# EAGLE design mbedshield040 (EAGLE 6.4)
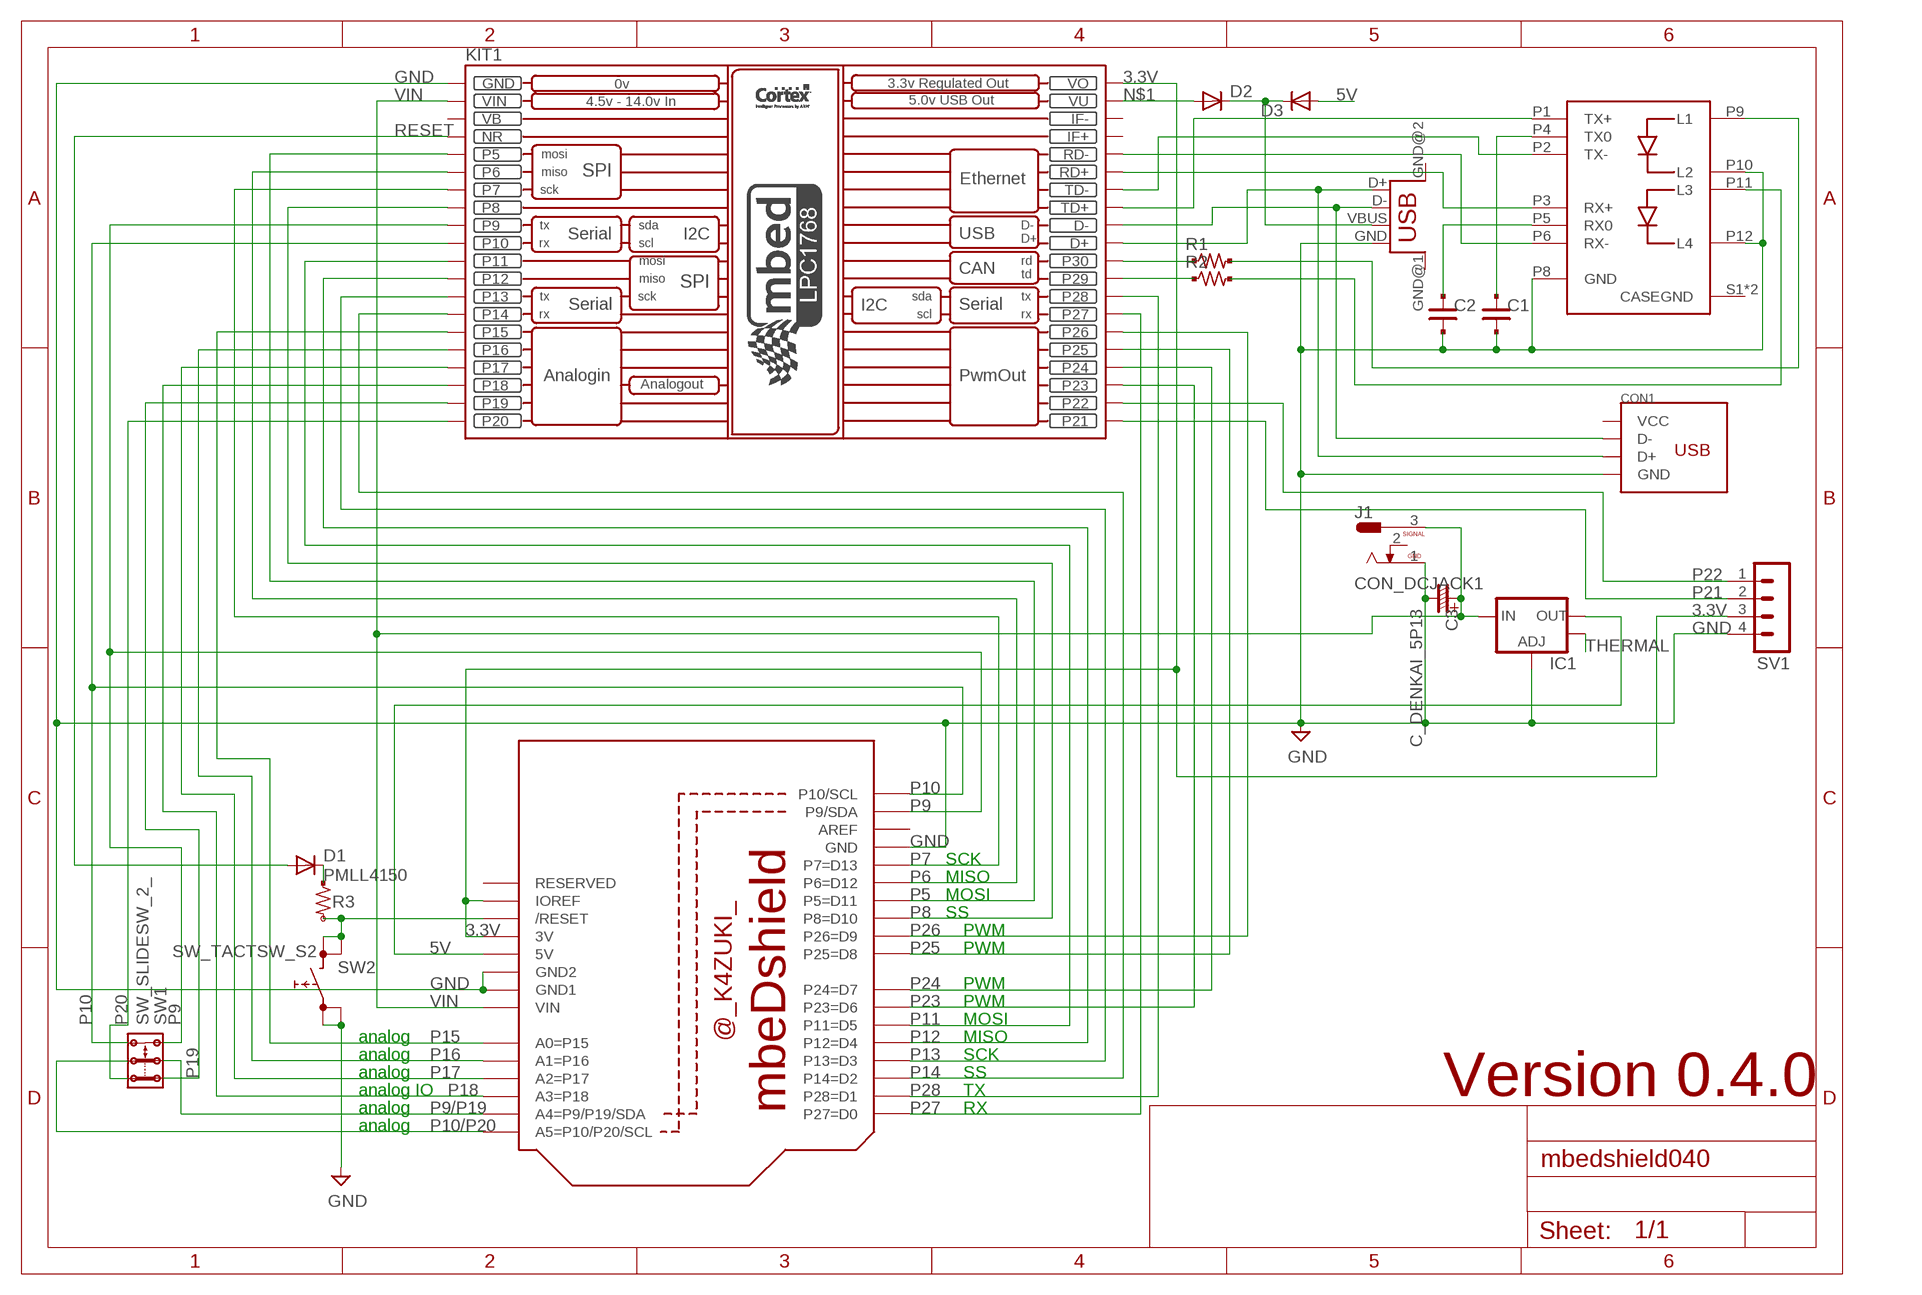
[diagram p0: schematic, sheet 1]

## Parts
C1  C_PAD_PAD_2125  [CR_2125]
C2  C_PAD_PAD_2125  [CR_2125]
C3  C_DENKAI_5P13  C_DENKAI_2.5P6  [C_2.5PHI6]
CON1  CON_USB  [CON_USB_MINIB_AKI]
D1  PMLL4150  [SOD80C]
D2  PMLL4150  [SOD80C]
D3  PMLL4150  [SOD80C]
IC1  V_REG_LM1117SOT223  [SOT223]
J1  CON_DCJACK1  [CON_DCJACK]
J2  CON_ETH_RJ45  [CON_LAN_RJ45_2LED_AKI]
KIT1  MBED_NXP_LPC1768  [MBED-KIT]
R1  R_US_PAD_PAD_1608  [R_1608_PADPAD]
R2  R_US_PAD_PAD_1608  [R_1608_PADPAD]
R3  R_US_PAD_VIA_2125  [R_2125_PADVIA]
SV1  MA04-1  [MA04-1]
SW1  SW_SLIDESW_2_  [SW_SLIDE_2X2_1]
SW2  SW_TACTSW_S2  [SW_TACTSW_B3F-10XX]
U$1  BOARD_MBEDSHIELD  [BOARD_MBEDSHIOELD]
USB  USB  [USB-FEMALE-A-PTH]

## Nets
3.3V: KIT1.VOUT(VO) SV1.3 U$1.3V U$1.IOREF
5V: D3.A IC1.2(OUT) U$1.5V
GND: C1.2 C2.2 C3.- CON1.GND IC1.1(ADJ) J1.1 J2.P8(GND) J2.P10(L2) J2.P12(L4) KIT1.GND SV1.4 SW2.1 SW2.2 U$1.GND U$1.GND1 U$1.GND2 USB.GND
N$1: D2.A KIT1.VU
N$27: D1.C R3.PAD
N$28: R3.VIA SW2.3 SW2.4 U$1.RESET(/RESET)
N$29: C1.1 J2.P4(TX0)
N$30: C2.1 J2.P5(RX0)
N$31: J2.P3(RX+) KIT1.RD+
N$32: J2.P6(RX-) KIT1.RD-
N$33: J2.P2(TX-) KIT1.TD-
N$34: J2.P1(TX+) KIT1.TD+
N$36: KIT1.P$30(P30) R1.1
N$37: KIT1.P$29(P29) R2.1
N$39: J2.P9(L1) R1.2
N$40: J2.P11(L3) R2.2
N$42: D2.C D3.C USB.VBUS
N$44: CON1.D- KIT1.D- USB.D-
N$45: CON1.D+ KIT1.D+ USB.D+
P5: KIT1.P$5(P5) U$1.D11(P5=D11)
P6: KIT1.P$6(P6) U$1.D12(P6=D12)
P7: KIT1.P$7(P7) U$1.D13(P7=D13)
P8: KIT1.P$8(P8) U$1.D10(P8=D10)
P9: KIT1.P$9(P9) SW1.2.1 U$1.SDA(P9/SDA)
P9/P19: SW1.COM.1 U$1.A4(A4=P9/P19/SDA)
P10: KIT1.P$10(P10) SW1.2.2 U$1.SCL(P10/SCL)
P10/P20: SW1.COM.2 U$1.A5(A5=P10/P20/SCL)
P11: KIT1.P$11(P11) U$1.D5(P11=D5)
P12: KIT1.P$12(P12) U$1.D4(P12=D4)
P13: KIT1.P$13(P13) U$1.D3(P13=D3)
P14: KIT1.P$14(P14) U$1.D2(P14=D2)
P15: KIT1.P$15(P15) U$1.A0(A0=P15)
P16: KIT1.P$16(P16) U$1.A1(A1=P16)
P17: KIT1.P$17(P17) U$1.A2(A2=P17)
P18: KIT1.P$18(P18) U$1.A3(A3=P18)
P19: KIT1.P$19(P19) SW1.1.1
P20: KIT1.P$20(P20) SW1.1.2
P21: KIT1.P$21(P21) SV1.2
P22: KIT1.P$22(P22) SV1.1
P23: KIT1.P$23(P23) U$1.D6(P23=D6)
P24: KIT1.P$24(P24) U$1.D7(P24=D7)
P25: KIT1.P$25(P25) U$1.D8(P25=D8)
P26: KIT1.P$26(P26) U$1.D9(P26=D9)
P27: KIT1.P$27(P27) U$1.D0(P27=D0)
P28: KIT1.P$28(P28) U$1.D1(P28=D1)
RESET: D1.A KIT1.NR
THERMAL: IC1.4(OUT)
VIN: C3.+ IC1.3(IN) J1.3 KIT1.VIN U$1.VIN
Unconnected: CON1.VBUS(VCC) J1.2 J2.S1(CASEGND) J2.S2(CASEGND) KIT1.IF+ KIT1.IF- U$1.AREF U$1.RESERVED USB.GND@1(GND) USB.GND@2(GND)

## Notes on the sheet
- SCK
- MISO
- MOSI
- SS
- PWM
- PWM
- PWM
- PWM
- MOSI
- analog | MISO
- analog | SCK
- analog | SS
- analog IO | TX | Version 0.4.0
- analog | RX
- analog

## Power pins joined to a net without a drawn wire
VB: KIT1.VB

## Library data of the parts
C1 C2 = mylib:C_PAD_PAD_: SMD CAPACITOR : PAD - PAD
C3 = mylib:C_DENKAI: (Device name) : (Main function of the device) Packages : (Variant name1) : (Pitch) x (Pin) x (Width) (Variant name2) : (Pitch) x (Pin) x (Width) (Variant name3) : (Pitch) x (Pin) x (Width) ...
CON1 = mylib:CON_USB: USB B CONNECTOR
D1-D3 = diode:PMLL4150: DIODE high speed
IC1 = SparkFun:V_REG_LM1117: Voltage Regulator LM1117 Standard adjustable voltage regulator but in SMD form. Spark Fun Electronics SKU : COM-00595
J1 = mylib:CON_DCJACK: DC JACK : 2.1 / 2.5 mm
J2 = mylib:CON_ETH_RJ45
KIT1 = MBED_v2.1:MBED_NXP_LPC1768: Mbed LPC1768 - ARM CORTEX v2.1 * Schematic symbol is now placed in eagles's default raster. *The pads diameter are suitable for routing between mbed pins * mbed pads are 0.8 mm drill diameter. --------------------------------------------- Created by: Mohamed Yousry *Alexandria, Egypt *Email: mohamed.yousry@ieeegoldegypt.org
R1 R2 = mylib:R_US_PAD_PAD: R_US_PAD_PAD : SMD R PAD is NTH-NTH Packages : _1608 : 1.6 x 0.8 mm _2125 : 2.0 x 1.25 mm _3216 : 3.2 x 1.6 mm
R3 = mylib:R_US_PAD_VIA: R_US_PAD_PAD : SMD R PAD is TH-NTH Packages : _1608 : 1.6 x 0.8 mm _2125 : 2.0 x 1.25 mm _3216 : 3.2 x 1.6 mm
SV1 = con-lstb:MA04-1: PIN HEADER; OC_FARNELL: unknown; OC_NEWARK: unknown
SW1 = mylib:SW_SLIDESW_2_
SW2 = mylib:SW_TACTSW_
U$1 = mylib:BOARD_MBEDSHIELD
USB = STUNTAZ:USB: USB Connectors USB-FEMALE-A-PTH: Through hole Female Type A Connector

## Net classes
0 signal: width 0.406 mm, drill 0.381 mm
1 power: width 0.813 mm, drill 0.381 mm

## Board
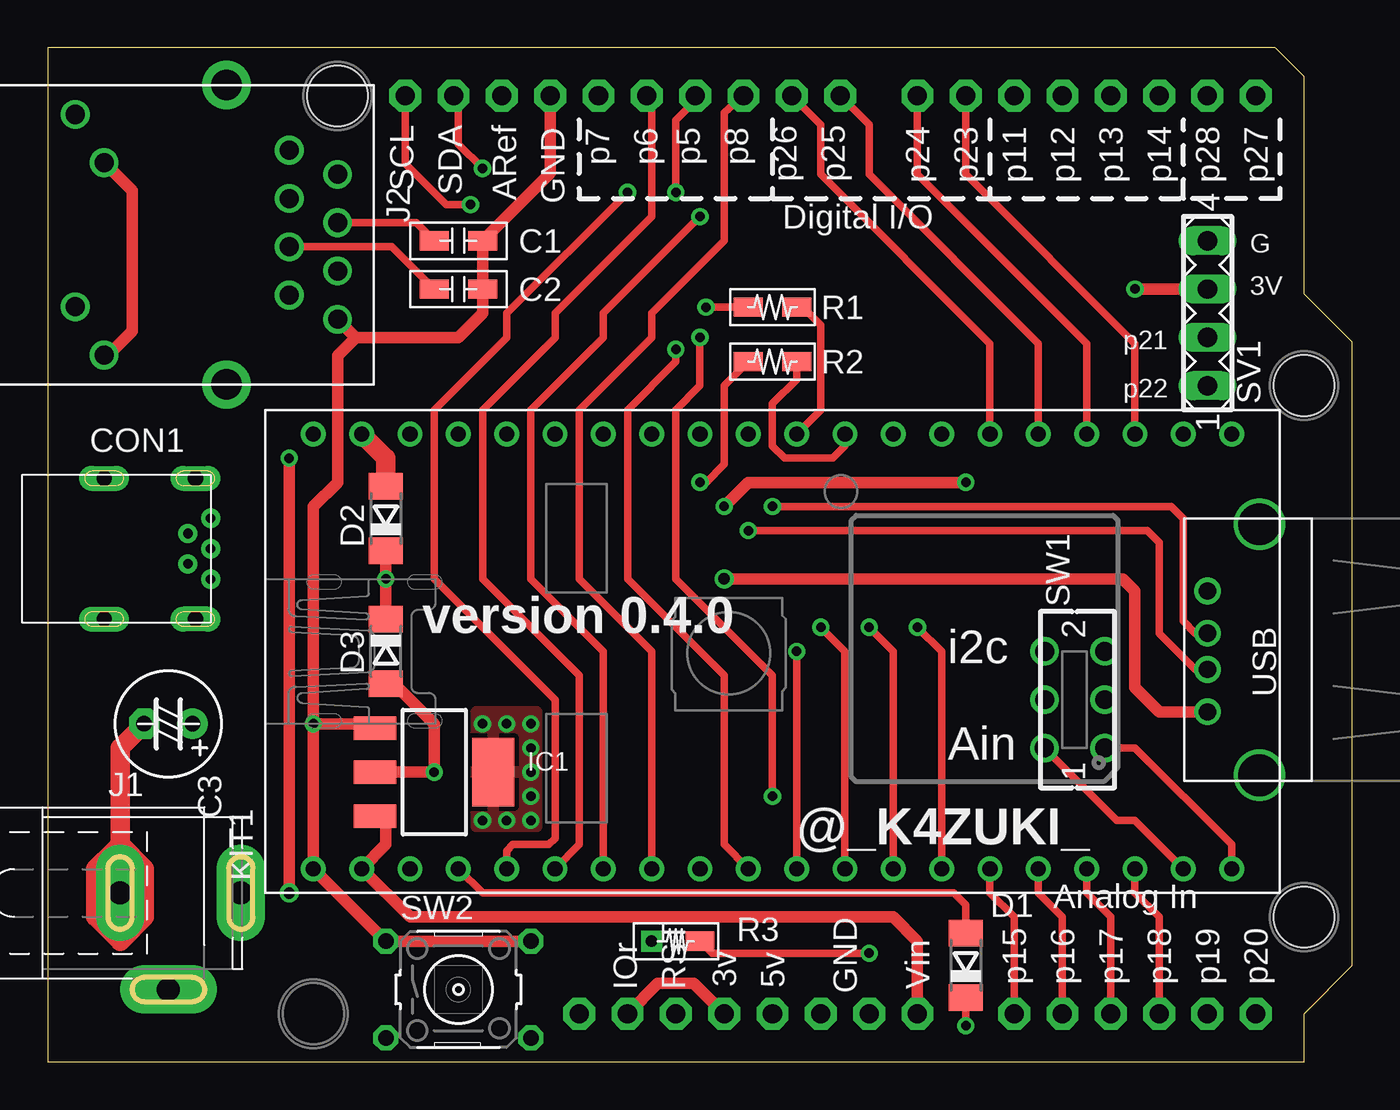
[diagram p1: board, top side]
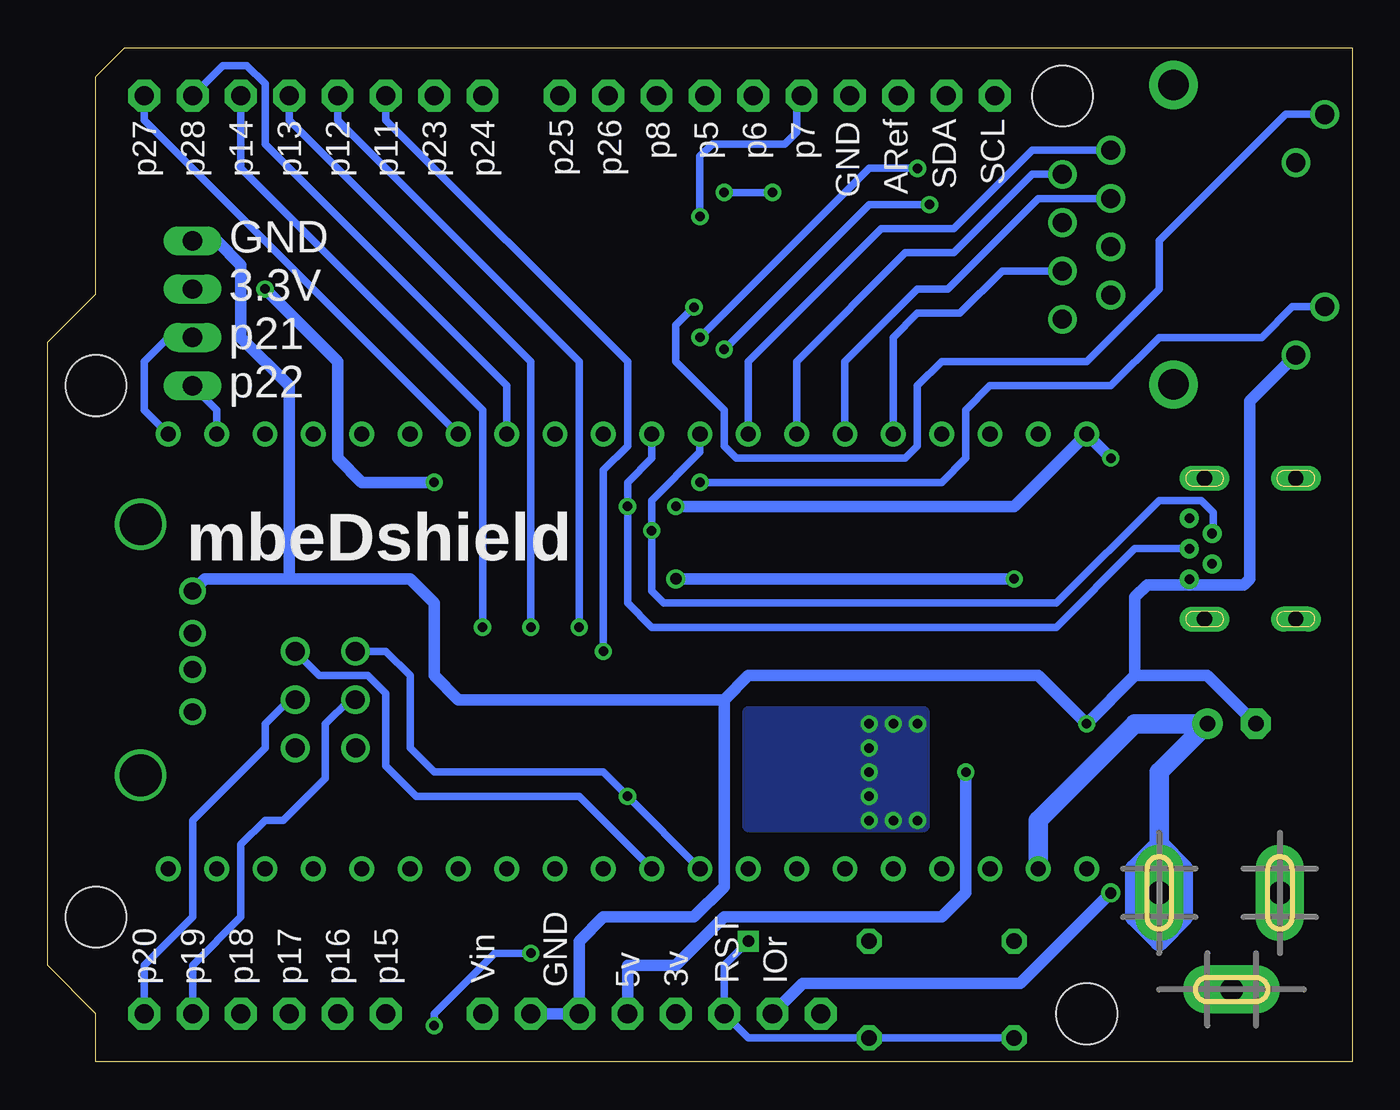
[diagram p2: board, bottom side, seen from below]

Size 68.58 x 53.34 mm. Coordinates in mm from the lower left corner, seen from the top.
Copper layers (1*16): Top 0.0356mm / dielectric 1.5011mm / Bottom 0.0356mm
Design rules "SilverCircuits *": minimum track width 10mil, minimum drill 15mil, track to track 8mil, track to pad 8mil, pad to pad 8mil, via to via 8mil, smd to smd 8mil, copper to edge 20mil, drill to drill 8mil, minimum pad ring 10mil, minimum via ring 8mil, stop-mask expansion 4mil, vias tented up to drill 100mil, thermal gap 10mil
Holes 3.2 mm at 66.04,35.56 66.04,7.62 13.97,2.54 15.24,50.8
Milling: 12 lines

### Footprints (pad centres in the part's own frame; a part is rotated, then mirrored left to right if it is on the bottom)
CR_2125 = smd 1.524 x 1.016: 1 -1.27,0; 2 1.27,0
C_2.5PHI6 = drill 0.813 pad 1.6: + -1.27,0 | drill 0.813 pad 1.6 octagon: - 1.27,0
CON_USB_MINIB_AKI = drill 0.5: D+ 0,0; D- -1.2,0.8; GND 0,-1.6; ID -1.2,-0.8; VBUS 0,1.6 | drill 0.8 long: G -5.6,-3.7; G@1 -5.6,3.7; G@2 -0.8,3.7; G@3 -0.8,-3.7
SOD80C = smd 1.4 x 1.8: A 1.7,0; C -1.7,0
SOT223 = smd 1.219 x 2.235: 1 -2.311,-3.099; 2 0,-3.099; 3 2.311,-3.099 | smd 3.6 x 2.2: 4 0,3.099
CON_DCJACK = drill 1.2 pad 2.54 long: 1 -0.635,0; 2 1.905,-5.08; 3 5.715,0
CON_LAN_RJ45_2LED_AKI = drill 1: P1 8.89,2.54; P2 7.62,0; P3 6.35,2.54; P4 5.08,0; P5 3.81,2.54; P6 2.54,0; P7 1.27,2.54; P8 0,0; P9 10.77,13.79; P10 8.23,12.27; P11 0.66,13.79; P12 -1.88,12.27 | drill 1.6 pad 2.54: S1 -3.43,5.84; S2 12.32,5.84
MBED-KIT = drill 0.8: D+ 11.43,1.27; D- 11.43,3.81; GND -11.43,24.13; IF+ 11.43,16.51; IF- 11.43,19.05; NR -11.43,16.51; P$5 -11.43,13.97; P$6 -11.43,11.43; P$7 -11.43,8.89; P$8 -11.43,6.35; P$9 -11.43,3.81; P$10 -11.43,1.27; P$11 -11.43,-1.27; P$12 -11.43,-3.81; P$13 -11.43,-6.35; P$14 -11.43,-8.89; P$15 -11.43,-11.43; P$16 -11.43,-13.97; P$17 -11.43,-16.51; P$18 -11.43,-19.05; P$19 -11.43,-21.59; P$20 -11.43,-24.13; P$21 11.43,-24.13; P$22 11.43,-21.59; P$23 11.43,-19.05; P$24 11.43,-16.51; P$25 11.43,-13.97; P$26 11.43,-11.43; P$27 11.43,-8.89; P$28 11.43,-6.35; P$29 11.43,-3.81; P$30 11.43,-1.27; RD+ 11.43,11.43; RD- 11.43,13.97; TD+ 11.43,6.35; TD- 11.43,8.89; VB -11.43,19.05; VIN -11.43,21.59; VOUT 11.43,24.13; VU 11.43,21.59
R_1608_PADPAD = smd 1.524 x 1.016: 1 -1.27,0; 2 1.27,0
R_2125_PADVIA = smd 1.524 x 1.016: PAD 1.27,0 | drill 0.61 square: VIA -1.27,0
MA04-1 = drill 1.016 long: 1 -3.81,0; 2 -1.27,0; 3 1.27,0; 4 3.81,0
SW_SLIDE_2X2_1 = drill 0.991: 1.1 -2.54,1.587; 1.2 -2.54,-1.587; 2.1 2.54,1.575; 2.2 2.54,-1.587; COM.1 0,1.575; COM.2 0,-1.587
SW_TACTSW_B3F-10XX = drill 0.813 octagon: 1 -3.81,2.54; 2 3.81,2.54; 3 -3.81,-2.54; 4 3.81,-2.54
BOARD_MBEDSHIOELD = drill 1 pad 1.676 octagon: 3V 35.56,2.54; 5V 38.1,2.54; A0 50.8,2.54; A1 53.34,2.54; A2 55.88,2.54; A3 58.42,2.54; A4 60.96,2.54; A5 63.5,2.54; AREF 23.876,50.8; D0 63.5,50.8; D1 60.96,50.8; D2 58.42,50.8; D3 55.88,50.8; D4 53.34,50.8; D5 50.8,50.8; D6 48.26,50.8; D7 45.72,50.8; D8 41.656,50.8; D9 39.116,50.8; D10 36.576,50.8; D11 34.036,50.8; D12 31.496,50.8; D13 28.956,50.8; GND 26.416,50.8; GND1 43.18,2.54; GND2 40.64,2.54; IOREF 30.48,2.54; RESERVED 27.94,2.54; RESET 33.02,2.54; SCL 18.796,50.8; SDA 21.336,50.8; VIN 45.72,2.54
USB-FEMALE-A-PTH = drill 0.9: D+ -0.953,0; D- 0.953,0; GND -3.175,0; VBUS 3.175,0 | drill 2.2: GND@1 6.515,2.73; GND@2 -6.685,2.73

### Placement (x,y rotation side)
C1  21.59,43.18 0 top
C2  21.59,40.64 0 top
C3  6.35,17.78 180 top
CON1  8.57,26.99 0 top
D1  48.26,5.08 90 top
D2  17.78,28.57 90 top
D3  17.78,21.59 270 top
IC1  20.32,15.24 270 top
J1  4.45,8.89 0 top
J2  15.24,39.05 90 top
KIT1  38.1,21.59 90 top
R1  38.1,39.69 180 top
R2  38.1,36.83 180 top
R3  33.02,6.35 0 top
SV1  60.96,39.37 90 top
SW1  53.98,19.05 90 top
SW2  21.59,3.81 0 top
U$1  0,0 0 top
USB  60.96,21.59 270 top

### Tracks (layer width: path | path; a pad name or v marks a point on that pad's centre or on a via)
3.3V  (via drill 0.5, 0.6)
  Top 0.61: v12.7,8.89 v12.7,31.75 | U$1.3V 33.97,4.13 32.07,4.13 U$1.IOREF | v57.15,40.64 SV1.3 | v48.26,30.48 36.83,30.48 v35.56,29.21
  Bottom 0.61: v12.7,31.75 KIT1.VOUT 17.78,29.21 v35.56,29.21 | v12.7,8.89 17.46,4.13 28.89,4.13 U$1.IOREF | v57.15,40.64 53.34,36.83 53.34,31.75 52.07,30.48 v48.26,30.48
5V  (via drill 0.5)
  Top 0.61: IC1.2 v20.32,15.24 20.32,17.78 18.21,19.89 D3.A
  Bottom 0.61: v20.32,15.24 20.32,8.89 21.59,7.62 33.02,7.62 35.56,5.08 38.1,5.08 U$1.5V
GND  (via drill 0.5)
  Top 0.61: 16.19,38.1 21.59,38.1 22.86,39.37 C2.2 C1.2 26.42,46.74 U$1.GND | v13.97,17.78 13.97,29.21 15.24,30.48 15.24,37.15 16.19,38.1 | v13.97,17.78 KIT1.GND SW2.1 SW2.2 | v13.97,17.78 17.22,17.78 IC1.1 | J2.P8 16.19,38.1 | J2.P12 3.2,37.17 4.45,38.42 4.45,45.81 J2.P10
  Top 1.016: C3.- 3.81,16.51 3.81,11.43 | 3.81,11.43 5.08,10.16 5.08,7.62 3.81,6.35 2.54,7.62 2.54,10.16 3.49,11.11 | 3.81,11.43 3.49,11.11 | J1.1 3.81,10.79 3.49,11.11
  Bottom 0.61: 33.02,19.05 31.75,20.32 16.51,20.32 v13.97,17.78 11.43,20.32 | 33.02,19.05 33.02,9.21 34.61,7.62 39.37,7.62 40.64,6.35 U$1.GND2 U$1.GND1 | 55.88,25.4 49.53,25.4 48.26,24.13 48.26,20.32 46.99,19.05 33.02,19.05 | 11.43,20.32 11.43,24.45 10.79,25.08 8.57,25.08 | 55.88,25.4 60.33,25.4 USB.GND | 55.88,25.4 55.88,35.56 58.42,38.1 58.42,41.91 59.69,43.18 SV1.4 | 11.43,20.32 7.62,20.32 C3.- | 8.57,25.08 5.71,25.08 5.4,25.4 5.4,34.74 J2.P12 | CON1.GND 8.57,25.08
N$1
  Top 1.016: D2.A 17.78,31.75 KIT1.VU
N$27  (via drill 0.5)
  Top 0.406: R3.PAD 34.92,5.71 v43.18,5.71 | v48.26,1.91 D1.C
  Bottom 0.406: v43.18,5.71 45.09,5.71 48.26,2.54 v48.26,1.91
N$28
  Bottom 0.406: R3.VIA 33.02,5.08 U$1.RESET 31.75,1.27 SW2.4 SW2.3
N$29
  Top 0.406: C1.1 19.37,44.13 J2.P4
N$30
  Top 0.406: C2.1 18.1,42.86 J2.P5
N$31
  Bottom 0.406: KIT1.RD+ 26.67,36.83 22.86,40.64 21.27,40.64 16.51,45.4 J2.P3
N$32
  Bottom 0.406: KIT1.RD- 24.13,38.1 22.86,39.37 20.64,39.37 18.41,41.59 J2.P6
N$33
  Bottom 0.406: KIT1.TD- 29.21,36.83 23.5,42.55 20.95,42.55 16.83,46.67 J2.P2
N$34
  Bottom 0.406: KIT1.TD+ 31.75,36.83 24.77,43.81 20.95,43.81 16.83,47.94 J2.P1
N$36
  Top 0.406: KIT1.P$30 40.64,34.29 40.64,38.73 39.69,39.69 R1.1
N$37
  Top 0.406: KIT1.P$29 41.91,32.38 41.27,31.75 38.73,31.75 38.1,32.38 38.1,34.61 39.37,35.88 R2.1
N$39  (via drill 0.5)
  Top 0.406: v34.61,39.69 R1.2
  Bottom 0.406: v34.61,39.69 35.56,38.73 35.56,36.83 33.02,34.29 33.02,32.38 32.38,31.75 23.5,31.75 22.86,32.38 22.86,35.56 21.59,36.83 13.97,36.83 10.16,40.64 10.16,43.18 3.52,49.82 J2.P9
N$40  (via drill 0.5)
  Top 0.406: v34.29,30.48 34.61,30.48 35.56,31.43 35.56,35.56 R2.2
  Bottom 0.406: v34.29,30.48 21.59,30.48 20.32,31.75 20.32,34.29 19.05,35.56 12.7,35.56 10.16,38.1 4.76,38.1 3.15,39.71 J2.P11
N$42  (via drill 0.5, 0.6)
  Top 0.61: v35.56,25.4 56.52,25.4 57.15,24.77 57.15,19.68 58.42,18.41 USB.VBUS | D3.C v17.78,25.4 D2.C
  Bottom 0.61: v17.78,25.4 v35.56,25.4
N$44  (via drill 0.5)
  Top 0.406: v36.83,27.94 57.78,27.94 58.42,27.3 58.42,22.54 60.33,20.64 USB.D-
  Bottom 0.406: KIT1.D- 34.29,32.07 36.83,29.53 v36.83,27.94 36.83,24.77 36.2,24.13 15.56,24.13 10.16,29.53 7.94,29.53 7.3,28.89 7.3,27.86 CON1.D-
N$45  (via drill 0.5)
  Top 0.406: v38.1,29.21 59.05,29.21 59.69,28.57 59.69,23.18 60.33,22.54 USB.D+
  Bottom 0.406: KIT1.D+ 36.83,31.75 38.1,30.48 v38.1,29.21 38.1,24.13 36.83,22.86 15.56,22.86 11.43,26.99 CON1.D+
P5  (via drill 0.5)
  Top 0.406: KIT1.P$5 24.13,11.11 24.45,11.43 26.35,11.43 26.67,11.75 26.67,19.05 20.32,25.4 20.32,34.29 24.13,38.1 24.13,39.37 v30.48,45.72 | v33.02,45.72 33.02,49.53 34.04,50.55 U$1.D11
  Bottom 0.406: v30.48,45.72 v33.02,45.72
P6
  Top 0.406: KIT1.P$6 27.94,11.43 27.94,20.32 22.86,25.4 22.86,34.29 26.67,38.1 26.67,39.37 31.75,44.45 31.75,50.55 U$1.D12
P7  (via drill 0.5)
  Top 0.406: KIT1.P$7 29.21,21.59 25.4,25.4 25.4,34.29 29.21,38.1 29.21,39.37 v34.29,44.45
  Bottom 0.406: v34.29,44.45 34.29,47.62 33.66,48.26 29.84,48.26 29.21,48.9 29.21,50.55 U$1.D13
P8
  Top 0.406: KIT1.P$8 31.75,21.59 27.94,25.4 27.94,34.29 31.75,38.1 31.75,39.37 35.56,43.18 35.56,49.91 U$1.D10
P9  (via drill 0.5)
  Top 0.406: v38.1,13.97 38.1,20.32 33.02,25.4 33.02,34.29 34.29,35.56 v34.29,38.1 | v22.86,46.99 21.59,48.26 21.59,50.55 U$1.SDA
  Bottom 0.406: v34.29,38.1 25.4,46.99 v22.86,46.99 | KIT1.P$9 v38.1,13.97 39.37,15.24 48.26,15.24 49.53,16.51 49.53,20.32 50.8,21.59 SW1.2.1
P9/P19
  Bottom 0.406: U$1.A4 60.96,5.08 58.42,7.62 58.42,11.43 57.15,12.7 56.2,12.7 53.98,14.92 53.98,17.78 52.7,19.05 SW1.COM.1
P10  (via drill 0.5)
  Top 0.406: KIT1.P$10 35.56,11.43 35.56,20.32 30.48,25.4 30.48,34.29 33.02,36.83 v33.02,37.47 | U$1.SCL 18.8,47.24 20.95,45.09 v22.23,45.09
  Bottom 0.406: v22.23,45.09 25.4,45.09 v33.02,37.47 | KIT1.P$10 40.64,13.97 49.21,13.97 50.8,15.56 50.8,19.37 51.75,20.32 54.29,20.32 SW1.2.2
P10/P20
  Bottom 0.406: U$1.A5 63.5,5.08 60.96,7.62 60.96,12.7 57.15,16.51 57.15,17.78 55.88,19.05 SW1.COM.2
P11  (via drill 0.5)
  Top 0.406: KIT1.P$11 v39.37,21.59
  Bottom 0.406: v39.37,21.59 39.37,31.11 38.1,32.38 38.1,36.83 50.8,49.53 U$1.D5
P12  (via drill 0.5)
  Top 0.406: KIT1.P$12 41.91,21.59 v40.64,22.86
  Bottom 0.406: v40.64,22.86 40.64,36.83 53.34,49.53 U$1.D4
P13  (via drill 0.5)
  Top 0.406: KIT1.P$13 44.45,21.59 v43.18,22.86
  Bottom 0.406: v43.18,22.86 43.18,36.83 55.88,49.53 U$1.D3
P14  (via drill 0.5)
  Top 0.406: KIT1.P$14 46.99,21.59 v45.72,22.86
  Bottom 0.406: v45.72,22.86 45.72,34.29 58.42,46.99 U$1.D2
P15
  Top 0.406: U$1.A0 50.8,7.62 49.53,8.89 KIT1.P$15
P16
  Top 0.406: U$1.A1 53.34,7.62 52.07,8.89 KIT1.P$16
P17
  Top 0.406: U$1.A2 55.88,7.62 54.61,8.89 KIT1.P$17
P18
  Top 0.406: U$1.A3 58.42,7.62 57.15,8.89 KIT1.P$18
P19
  Top 0.406: KIT1.P$19 57.15,12.7 56.2,12.7 SW1.1.1
P20
  Top 0.406: KIT1.P$20 62.23,11.43 57.15,16.51 SW1.1.2
P21
  Bottom 0.406: KIT1.P$21 63.5,34.29 63.5,36.83 62.23,38.1 SV1.2
P22
  Bottom 0.406: KIT1.P$22 59.69,34.29 SV1.1
P23
  Top 0.406: KIT1.P$23 57.15,37.78 48.26,46.67 U$1.D6
P24
  Top 0.406: KIT1.P$24 54.61,37.78 45.72,46.67 U$1.D7
P25
  Top 0.406: KIT1.P$25 52.07,37.78 43.18,46.67 43.18,49.28 U$1.D8
P26
  Top 0.406: KIT1.P$26 49.53,37.78 40.64,46.67 40.64,49.28 U$1.D9
P27
  Bottom 0.406: KIT1.P$27 63.5,49.53 U$1.D0
P28
  Bottom 0.406: KIT1.P$28 44.45,35.56 57.15,48.26 57.15,51.44 58.1,52.39 59.37,52.39 U$1.D1
RESET
  Top 0.406: KIT1.NR 22.86,8.89 47.62,8.89 48.26,8.26 D1.A
THERMAL  (via drill 0.5)
  other vias: 22.86,17.78 24.13,17.78 25.4,17.78 25.4,16.51 25.4,15.24 25.4,13.97 25.4,12.7 24.13,12.7 22.86,12.7
  pour Bottom: 22.54,18.41 31.75,18.41 31.75,12.38 22.54,12.38
  pour Top: 22.54,18.41 25.72,18.41 25.72,12.38 22.54,12.38
VIN
  Top 0.61: 17.78,12.85 17.78,11.43 KIT1.VIN 19.05,7.62 44.45,7.62 45.72,6.35 U$1.VIN
  Top 1.016: 17.78,12.85 IC1.3
  Bottom 1.016: KIT1.VIN 16.51,12.7 11.43,17.78 C3.+ 10.16,15.24 10.16,11.43 | 10.16,11.43 11.43,10.16 11.43,7.62 10.16,6.35 8.89,7.62 8.89,10.16 10.16,11.43 | 10.16,11.43 J1.3

### Text on the board
tPlace: G | 3V | p21 | p22 | version 0.4.0 | i2c | Ain | @_K4ZUKI_
bPlace: GND | 3.3V | p21 | p22 | mbeDshield